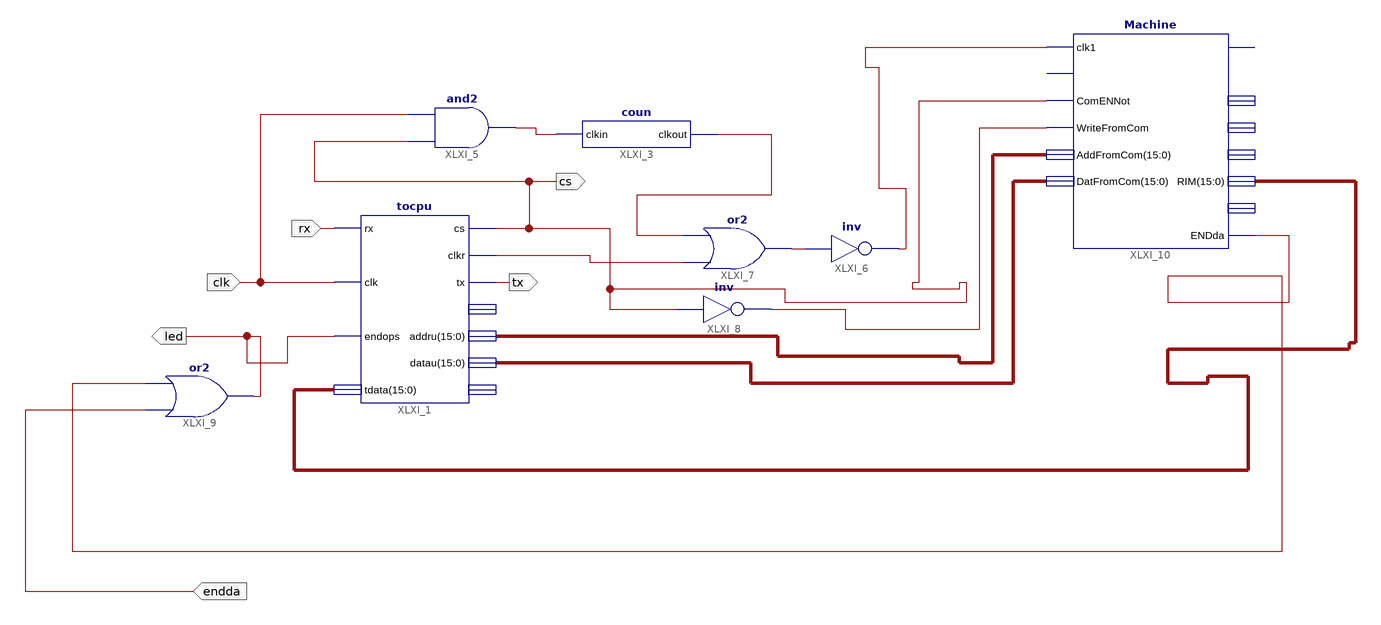
[diagram p0: schematic sheet 1]
// Xilinx ISE schematic FPGA.sch (spartan6) as structural Verilog: 8 symbols, 6 ports
module FPGA (
  input  rx,
  input  clk,
  input  endda,
  output cs,
  output tx,
  output led
);

  wire XLXN_4, XLXN_5, XLXN_6, XLXN_7, XLXN_9, XLXN_25, XLXN_27;
  wire [15:0] XLXN_10, XLXN_11, XLXN_24;

  tocpu XLXI_1 (
    .rx(rx), .clk(clk), .endops(led), .tdata(XLXN_24), .cs(cs), .clkr(XLXN_7), .tx(tx), .addru(XLXN_10),
    .datau(XLXN_11));  // open: count, dataout
  coun XLXI_3 (.clkin(XLXN_4), .clkout(XLXN_6));
  and XLXI_5 (XLXN_4, cs, clk);
  not XLXI_6 (XLXN_27, XLXN_5);
  or XLXI_7 (XLXN_5, XLXN_7, XLXN_6);
  not XLXI_8 (XLXN_9, cs);
  or XLXI_9 (led, endda, XLXN_25);
  Machine XLXI_10 (
    .clk1(XLXN_27), .ComENNot(cs), .WriteFromCom(XLXN_9), .AddFromCom(XLXN_10), .DatFromCom(XLXN_11),
    .ENDda(XLXN_25), .RIM(XLXN_24));  // open: en, z1, datadown, Buss, dummy, Arima
endmodule
